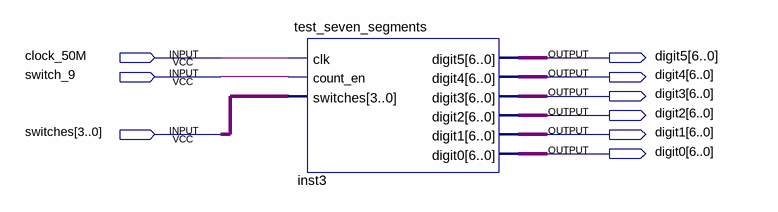
[diagram p0: schematic sheet]
// Quartus schematic seven_segments.bdf as structural Verilog: 1 symbols, 9 pins
module seven_segments (
  input  clock_50M,
  input  switch_9,
  input  [3:0] switches,
  output [6:0] digit5,
  output [6:0] digit4,
  output [6:0] digit3,
  output [6:0] digit2,
  output [6:0] digit1,
  output [6:0] digit0
);

  test_seven_segments inst3 (
    .clk(clock_50M), .count_en(switch_9), .switches(switches), .digit5(digit5), .digit4(digit4),
    .digit3(digit3), .digit2(digit2), .digit1(digit1), .digit0(digit0));
endmodule
